# Altium schematic sheet DAM10_Control.SchDoc
size A3
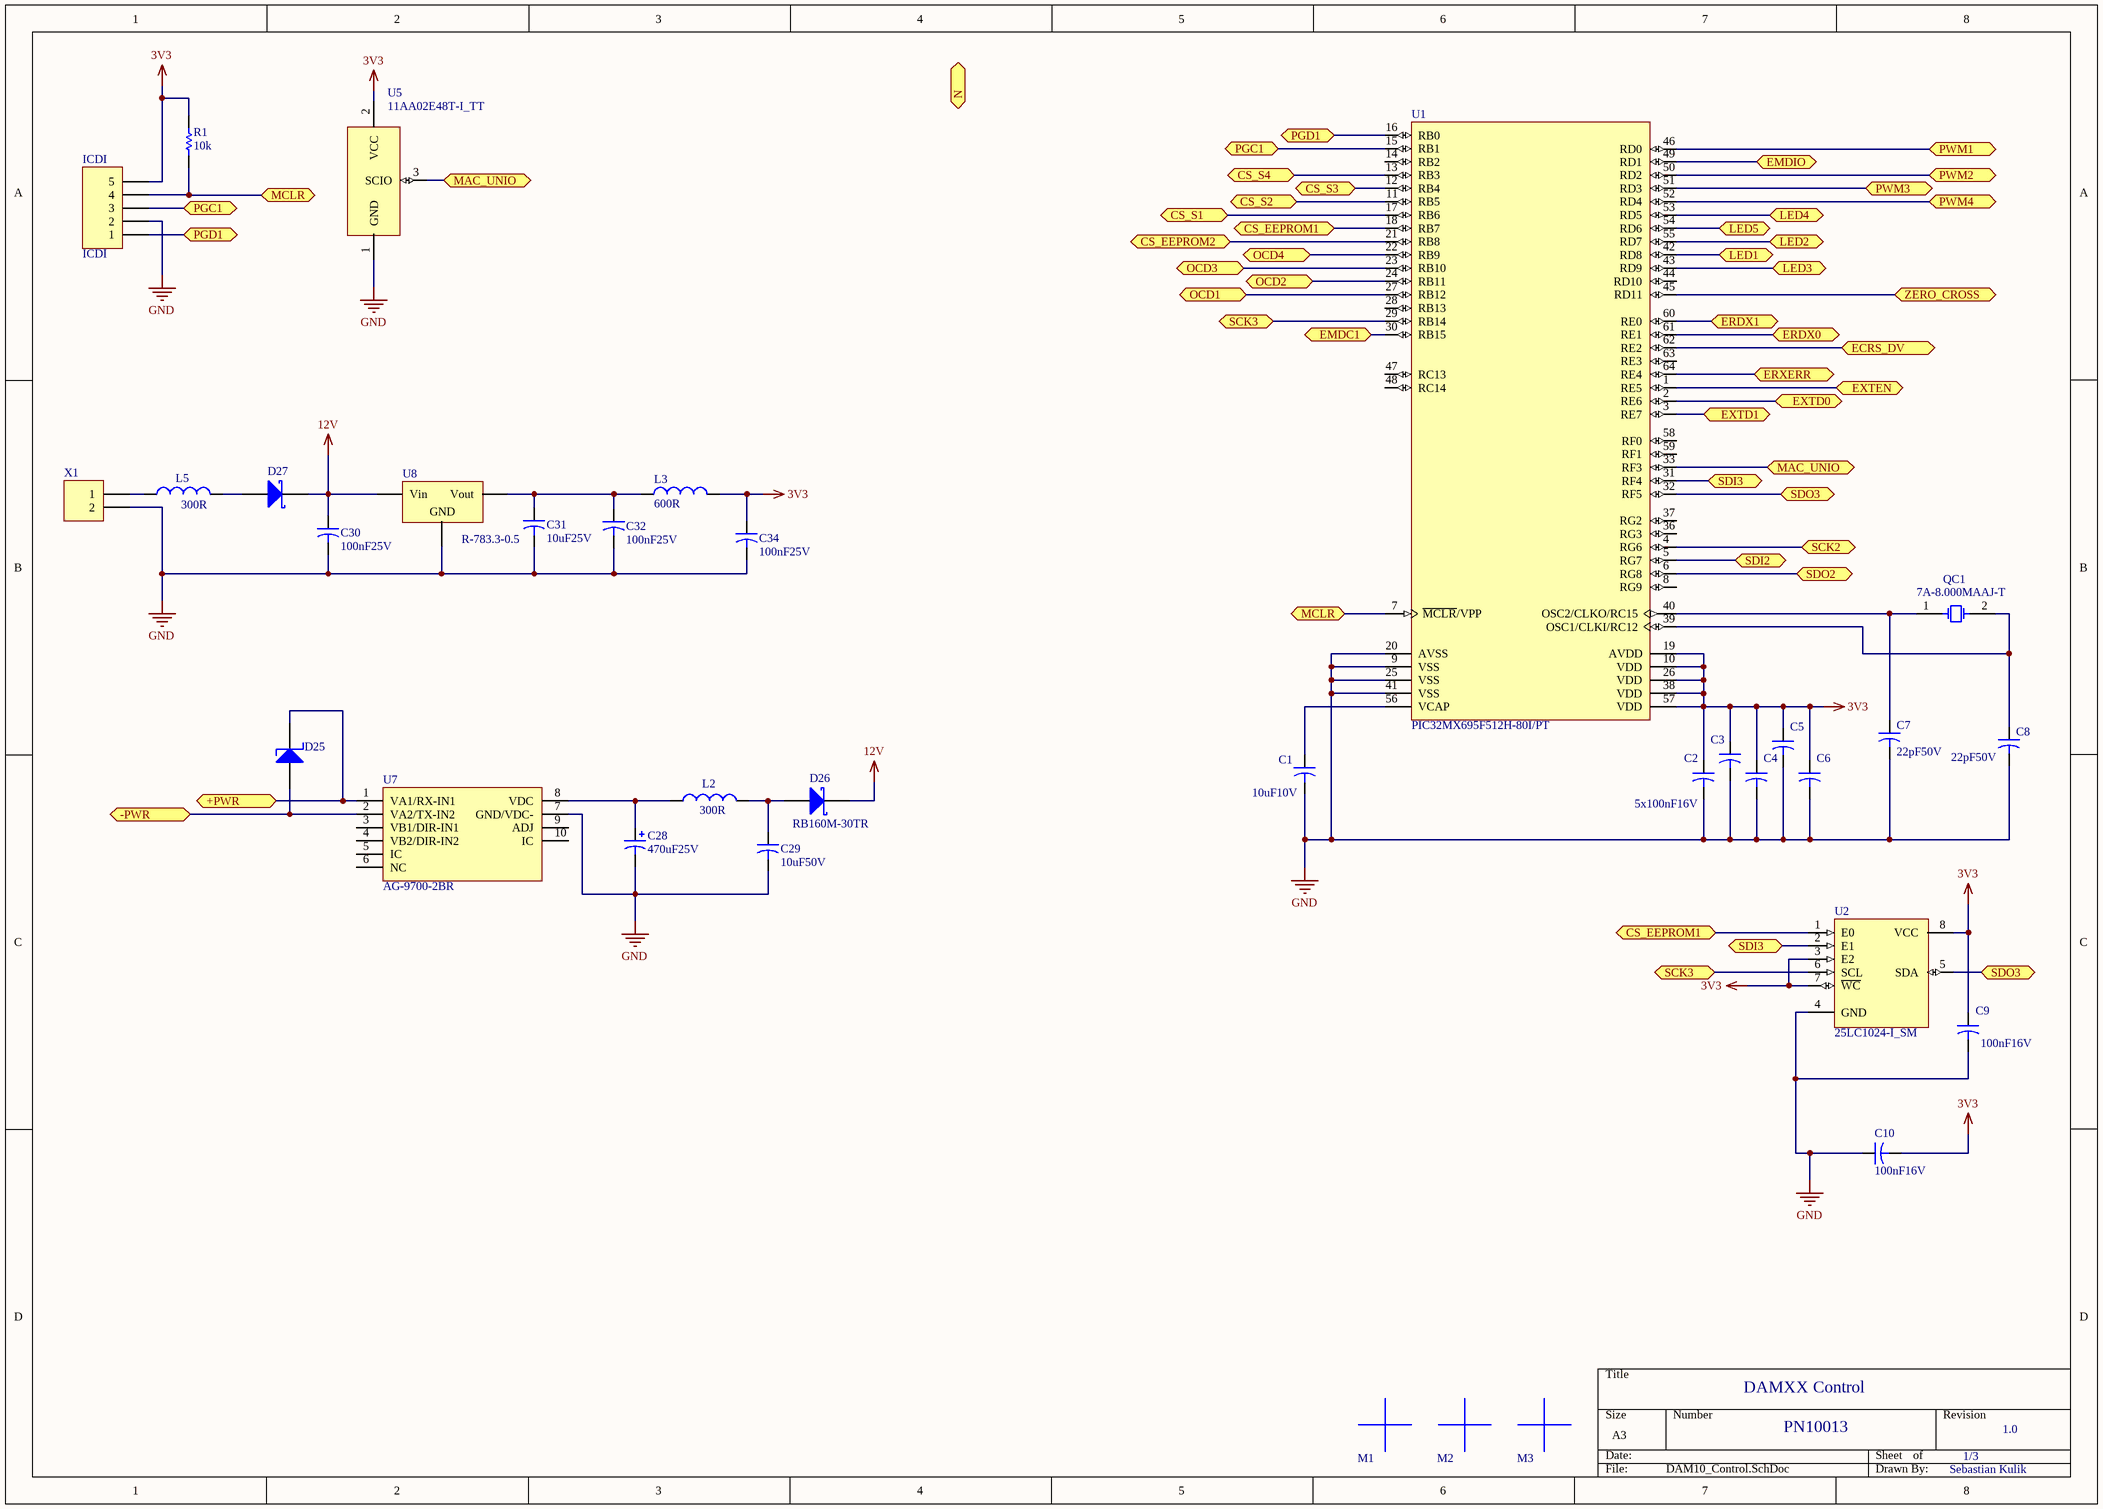
[diagram p0: DAM10_Control.SchDoc]

## Parts
C1  value 10uF10V  [C0603]  (hidden comment: 10uF10V_0603)
C2  100nF16V_0402  [C0402]  (value not drawn)
C3  100nF16V_0402  [C0402]  (value not drawn)
C4  100nF16V_0402  [C0402]  (value not drawn)
C5  100nF16V_0402  [C0402]  (value not drawn)
C6  100nF16V_0402  [C0402]  (value not drawn)
C7  value 22pF50V  [C0402]  (hidden comment: 22pF50V_0402)
C8  value 22pF50V  [C0402]  (hidden comment: 22pF50V_0402)
C9  value 100nF16V  [C0402]  (hidden comment: 100nF16V_0402)
C10  value 100nF16V  [C0402]  (hidden comment: 100nF16V_0402)
C28  value 470uF25V  [Panasonic-H13]  (hidden comment: 470uF25V_POL)
C29  value 10uF50V  [C1210]  (hidden comment: 10uF50V_1210)
C30  value 100nF25V  [C0402]  (hidden comment: 100nF25V_0402)
C31  value 10uF25V  [C1210]  (hidden comment: 10uF25V_1210)
C32  value 100nF25V  [C0402]  (hidden comment: 100nF25V_0402)
C34  value 100nF25V  [C0402]  (hidden comment: 100nF25V_0402)
D25  SMAJ58A-E3/61  [DO214A]  (value not drawn)
D26  RB160M-30TR  [SOD123]
D27  SD103AW-V-GS08  [SOD123]  (value not drawn)
ICDI  ICDI  [HDR1X5-1.27]
L2  value 300R  [L0603]  (hidden comment: 300R2A_0603)
L3  value 600R  [P0402]  (hidden comment: 120R1.2A_0402)
L5  value 300R  [L0603]  (hidden comment: 10uF2A)
M1  Mark  [Mark-3mm]  (value not drawn)
M2  Mark  [Mark-3mm]  (value not drawn)
M3  Mark  [Mark-3mm]  (value not drawn)
QC1  7A-8.000MAAJ-T  [TXC_7A]
R1  value 10k  [R0402]  (hidden comment: 10k_0402)
U1  PIC32MX695F512H-80I/PT  [TQFP-64_N1]
U2  25LC1024-I_SM  [SOP8_N]
U5  11AA02E48T-I_TT  [SOT23_M]
U7  AG-9700-2BR  [Ag9700-2BR]
U8  R-783.3-0.5  [R-783_3-0_5]
X1  WR-TBL3127  [WR-TBL-3127]  (value not drawn)

## Ports
+PWR, -PWR, CS_EEPROM1, CS_EEPROM2, CS_S1, CS_S2, CS_S3, CS_S4, ECRS_DV, EMDC1, EMDIO, ERDX0, ERDX1, ERXERR, EXTD0, EXTD1, EXTEN, LED1, LED2, LED3, LED4, LED5, MAC_UNIO, MCLR, N, OCD1, OCD2, OCD3, OCD4, PGC1, PGD1, PWM1, PWM2, PWM3, PWM4, SCK2, SCK3, SDI2, SDI3, SDO2, SDO3, ZERO_CROSS

## Nets
3V3: C2.1 C3.1 C4.1 C5.1 C6.1 C9.1 C10.2 C34.1 ICDI.5 L3.2 R1.2 U1.10(VDD) U1.19(AVDD) U1.26(VDD) U1.38(VDD) U1.57(VDD) U2.3(E2) U2.7(~{WC}) U2.8(VCC) U5.2(VCC)
12V: C30.1 D26.1(K) D27.1(K) U8.1(Vin)
GND: C1.2 C2.2 C3.2 C4.2 C5.2 C6.2 C7.2 C8.2 C9.2 C10.1 C28.2 C29.2 C30.2 C31.2 C32.2 C34.2 ICDI.2 U1.9(VSS) U1.20(AVSS) U1.25(VSS) U1.41(VSS) U2.4(GND) U5.1(GND) U7.7(GND/VDC-) U8.2(GND) X1.2
+PWR: D25.1(K) U7.1(VA1/RX-IN1) ; port +PWR
-PWR: D25.2(A) U7.2(VA2/TX-IN2) ; port -PWR
CS_EEPROM1: U1.18(RB7) U2.1(E0) ; port CS_EEPROM1
CS_EEPROM2: U1.21(RB8) ; port CS_EEPROM2
CS_S1: U1.17(RB6) ; port CS_S1
CS_S2: U1.11(RB5) ; port CS_S2
CS_S3: U1.12(RB4) ; port CS_S3
CS_S4: U1.13(RB3) ; port CS_S4
ECRS_DV: U1.62(RE2) ; port ECRS_DV
EMDC1: U1.30(RB15) ; port EMDC1
EMDIO: U1.49(RD1) ; port EMDIO
ERDX0: U1.61(RE1) ; port ERDX0
ERDX1: U1.60(RE0) ; port ERDX1
ERXERR: U1.64(RE4) ; port ERXERR
EXTD0: U1.2(RE6) ; port EXTD0
EXTD1: U1.3(RE7) ; port EXTD1
EXTEN: U1.1(RE5) ; port EXTEN
LED1: U1.42(RD8) ; port LED1
LED2: U1.55(RD7) ; port LED2
LED3: U1.43(RD9) ; port LED3
LED4: U1.53(RD5) ; port LED4
LED5: U1.54(RD6) ; port LED5
MAC_UNIO: U1.33(RF3) U5.3(SCIO) ; port MAC_UNIO
MCLR: ICDI.4 R1.1 U1.7(~{MCLR}/VPP) ; port MCLR
OCD1: U1.27(RB12) ; port OCD1
OCD2: U1.24(RB11) ; port OCD2
OCD3: U1.23(RB10) ; port OCD3
OCD4: U1.22(RB9) ; port OCD4
PGC1: ICDI.3 U1.15(RB1) ; port PGC1
PGD1: ICDI.1 U1.16(RB0) ; port PGD1
PWM1: U1.46(RD0) ; port PWM1
PWM2: U1.50(RD2) ; port PWM2
PWM3: U1.51(RD3) ; port PWM3
PWM4: U1.52(RD4) ; port PWM4
SCK2: U1.4(RG6) ; port SCK2
SCK3: U1.29(RB14) U2.6(SCL) ; port SCK3
SDI2: U1.5(RG7) ; port SDI2
SDI3: U1.31(RF4) U2.2(E1) ; port SDI3
SDO2: U1.6(RG8) ; port SDO2
SDO3: U1.32(RF5) U2.5(SDA) ; port SDO3
ZERO_CROSS: U1.45(RD11) ; port ZERO_CROSS
NetC1_1: C1.1 U1.56(VCAP)
NetC7_1: C7.1 QC1.1(E/D) U1.40(OSC2/CLKO/RC15)
NetC8_1: C8.1 QC1.2(GND) U1.39(OSC1/CLKI/RC12)
NetC28_1: C28.1 L2.1 U7.8(VDC)
NetC29_1: C29.1 D26.2(A) L2.2
NetC31_1: C31.1 C32.1 L3.1 U8.3(Vout)
NetD27_2: D27.2(A) L5.2
NetL5_1: L5.1 X1.1

Not connected (* = marked no-connect by the designer): U1 8(RG9) 14(RB2) 28(RB13) 36(RG3) 37(RG2) 44(RD10) 47(RC13) 48(RC14) 58(RF0) 59(RF1) 63(RE3); U7 3(VB1/DIR-IN1) 4(VB2/DIR-IN2) 5(IC) 6(NC) 9(ADJ) 10(IC)

## Notes on the sheet
- (near C2) 5x100nF16V
- DAMXX Control
- PN10013
- 1/3
- 1.0
- Sebastian Kulik

## Library data of the parts
C1 = 10uF10V_0603: Capacitor; Part Description: AVX ,  X5R, 20%, 10V; Deliverer PartNr: 1867954RL; Manufacturer: AVX; Manufacturer PartNr: 0603ZD106MAT2A; Deliverer: Farnell; TDFE-PN: C0016; Published: 11.02.2014; Publisher: Sebastian Kulik; PackageDescription: C0603
C2-C6 C9 C10 = 100nF16V_0402: Capacitor; Part Description: TDK. CGA series, X7R, 10%, 16V; Deliverer PartNr: 2210748RL; Manufacturer: TDK; Manufacturer PartNr: CGA2B1X7R1C104K050BC; Deliverer: Farnell; TDFE-PN: C0025; Published: 12.02.2014; Publisher: Sebastian Kulik; PackageDescription: C0403
  C2-C6: Value: 100nF16V
C7 C8 = 22pF50V_0402: Murata, GRM series, 50V; Deliverer PartNr: 8819629RL; Manufacturer PartNr: GRM1555C1H220JZ01D; Deliverer: Farnell; TDFE-PN: C0021; Published: 11.02.2014; Part Description: Murata, GRM series, 50V; Publisher: Sebastian Kulik; PackageDescription: C0403; Manufacturer: Murata
C28 = 470uF25V_POL: Panasonic, TG series; Deliverer PartNr: 2282114; Manufacturer PartNr: EEV-TG1E471Q; Deliverer: Farnell; TDFE-PN: C0038; Published: 17.02.2014; Part Description: Panasonic, TG series; Publisher: Sebastian Kulik; Manufacturer: Panasonic
C29 = 10uF50V_1210: AVX,  X7R, 10%, 50V; Deliverer PartNr: 2094047RL; Manufacturer PartNr: 12105C106KAT2A; Deliverer: Farnell; TDFE-PN: C0039; Published: 17.02.2014; Part Description: AVX,  X7R, 10%, 50V; Publisher: Sebastian Kulik; PackageDescription: C1210; Manufacturer: AVX
C30 C32 C34 = 100nF25V_0402: AVX, X5R, 10%, 25V; Deliverer PartNr: 2280767; Manufacturer PartNr: 04023D104KAT2A; Deliverer: Farnell; TDFE-PN: C0036; Published: 13.02.2014; Part Description: AVX, X5R, 10%, 25V; Publisher: Sebastian Kulik; PackageDescription: C0403; Manufacturer: AVX
C31 = 10uF25V_1210: Capacitor; Part Description: TDK  C series, X5R, 10%, 25V; Deliverer PartNr: 2346957; Manufacturer: TDK; Manufacturer PartNr: C3225X5R1E106K250AA; Deliverer: Farnell; TDFE-PN: C0014; Published: 12.02.2014; Publisher: Sebastian Kulik; PackageDescription: C1210
D25 = SMAJ58A-E3/61: TVS, 400W, 58V; Deliverer PartNr: 1837053; Manufacturer: Vishay; TDE-PN: DIS0009; Deliverer: Farnell; Published: 17.02.2014; PackageReference: DO214AC; Publisher: Sebastian Kulik; PackageDescription: DO214AC; Manufacturer PartNr: SMAJ58A-E3/61
D26 = RB160M-30TR: Diode Schottky,2A,40V; Deliverer PartNr: 1525480; Manufacturer: Rohm; TDE-PN: DIS0010; Deliverer: Farnell; Published: 17.02.2014; PackageReference: SOD123; Publisher: Sebastian Kulik; PackageDescription: SOD123; Manufacturer PartNr: RB160M-30TR
D27 = SD103AW-V-GS08: Diode Schottky,2A,40V; Deliverer PartNr: 1617720RL; Manufacturer: Vishay; TDE-PN: DIS0008; Deliverer: Farnell; Published: 12.02.2014; PackageReference: TO-220AC; Publisher: Sebastian Kulik; PackageDescription: SOD123; Manufacturer PartNr: SD103AW-V-GS08
ICDI = ICDI: Header, 5-Pin; LatestRevisionDate: 17-Jul-2002; LatestRevisionNote: Re-released for DXP Platform.; Publisher: Sebastian Kulik
L2 L5 = 300R2A_0603: WE, Ferrit, 300Rx2A; Deliverer PartNr: 1635705; Manufacturer PartNr: 742792641; Deliverer: Farnell; TDE-PN: P0021; Manufacturer: WE; Published: 26.05.2014; Publisher: Sebastian Kulik
L3 = 120R1.2A_0402: Ferrit, 1.2A, 120R@100MHz; Deliverer PartNr: 1961699RL; Manufacturer: WE; Manufacturer PartNr: 7427927311; Deliverer: Farnell; TDE-PN: P0022; Published: 26.05.2014; Publisher: Sebastian Kulik
QC1 = Crystal_8MHz: Crystal, 7A-8.000MAAJ-T; Deliverer PartNr: 1892148; Manufacturer: TXC; Deliverer: Farnell; TDE-PN: P0003; Published: 14.02.2014; PackageReference: 7A; Publisher: Sebastian Kulik; Manufacturer PartNr: 7A-8.000MAAJ-T
R1 = 10k_0402: Vishay CRCW series, 125mW, 1%; Manufacturer PartNr: CRCW040210K0FKEAHP; Deliverer PartNr: 1738864; TDE-PN: R0012; Deliverer: Farnell; Published: 12.02.2014; PackageReference: 0402; Publisher: Sebastian Kulik; PackageDescription: 0402; Manufacturer: Vishay; Part Description: Vishay CRCW series, 125mW, 1%
U1 = PIC32MX695F512H-80I/PT: High Performance ROM-less Microcontroller with External Memory Bus, 1.5K RAM, 64-Pin TQFP, 4.2 to 5.5V Supply Range, Industrial Temperature; Deliverer PartNr: 1778975; Manufacturer: Microchip; Deliverer: Farnell; TDE-PN: IC0031; Published: 11.02.2014; PackageReference: TQFP-64; Publisher: Sebastian Kulik; PackageDescription: 64-Pin Thin Plastic Quad Flat Pack 0.5 mm Pitch, 1.0/0.1 mm Lead Form; Manufacturer PartNr: PIC32MX695F512H-80I/PT
U2 = 25LC1024-I_SM: 1024 Kbit Serial SPI Bus EEPROM; Deliverer PartNr: 1331393; Manufacturer: Microchip; Deliverer: Farnell; TDE-PN: IC0033; Published: 12.02.2014; PackageReference: SOP8; Publisher: Sebastian Kulik; Manufacturer PartNr: 25LC1024-I_SM
U5 = 11AA02E48T-I_TT: 2 kbit Serial  EEPROM; Deliverer PartNr: 1707616RL; Manufacturer PartNr: 11AA02E48T-I/TT; Manufacturer: Microchip; Deliverer: Farnell; TDE-PN: IC0035; Published: 12.02.2014; PackageReference: SOT23; Publisher: Sebastian Kulik
U7 = AG-9700-2BR: PoE, 12V, 12W; Manufacturer: Silvertel; TDE-PN: IC0047; Published: 23.05.2014; Deliverer PartNr: -; Deliverer: -; PackageReference: TSSOP8; Publisher: Sebastian Kulik; Manufacturer PartNr: AG-9700-2BR
U8 = Recom-R-783_3-0_5: Voltage Regulator; Manufacturer: Recom; Deliverer PartNr: 532-8044; TDE-PN: IC0032; Deliverer: RS-Components; Published: 12.02.2014; Manufacturer PartNr: R-783.3-0.5; PackageReference: D2PAK; Publisher: Sebastian Kulik
X1 = Header-2-WR-TBL3127: Header 2 pin, horizontal,WR-TBL3127; Manufacrurer PartNr: 691312710002; Manufacturer: WE; Deliverer PartNr: 1841288; Deliverer: Farnell; TDE-PN: CON0014; LatestRevisionDate: 28.05.2014; LatestRevisionNote: Re-released for DXP Platform.; Publisher: Sebastian Kulik